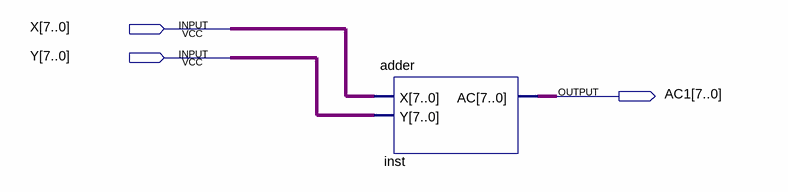
[diagram p0: schematic sheet]
// Quartus schematic test.bdf as structural Verilog: 1 symbols, 3 pins
module test (
  input  [7:0] X,
  input  [7:0] Y,
  output [7:0] AC1
);

  adder inst (.X(X), .Y(Y), .AC(AC1));
endmodule
